# EAGLE design Smart Extruder Board (EAGLE 6.6.0)
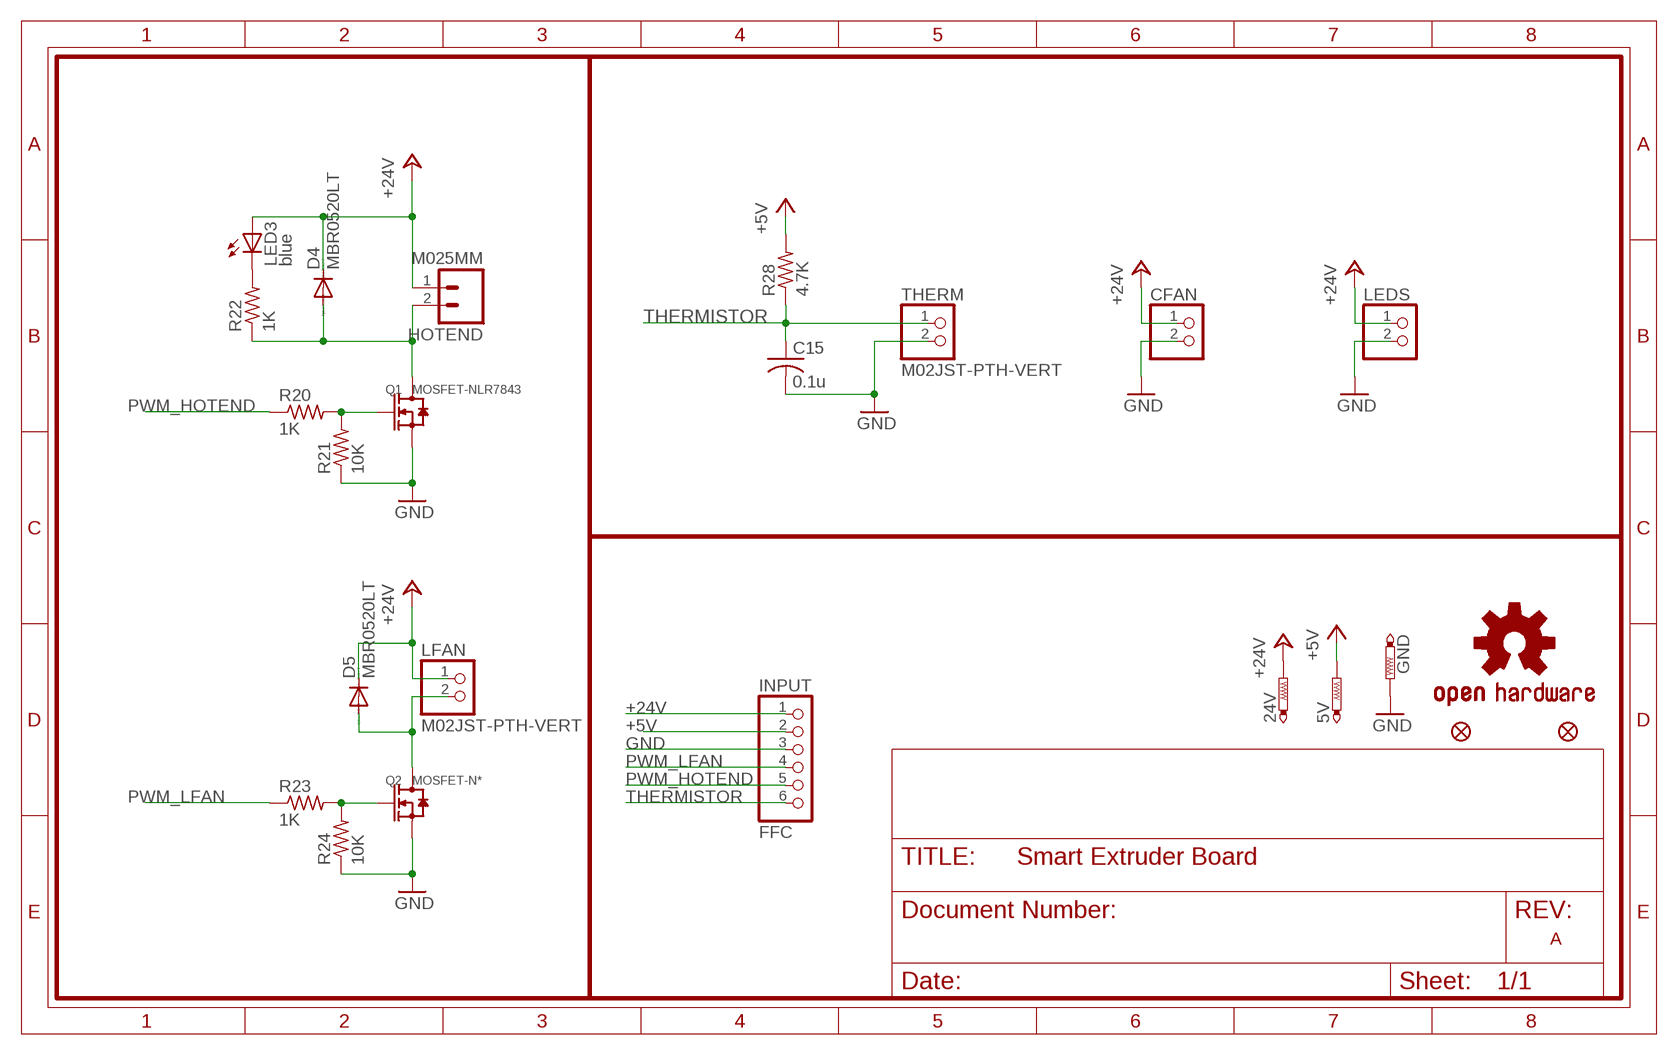
[diagram p0: schematic, sheet 1]

## Parts
5V  PTR1TP10SQ  [TP10SQ]
24V  PTR1TP10SQ  [TP10SQ]
C15  0.1u  C-USC0805  [C0805]
CFAN  PINHD-1X2/90  [1X02/90]
D4  MBR0520LT  [SOD123]
D5  MBR0520LT  [SOD123]
GND  PTR1TP10SQ  [TP10SQ]
HOTEND  M025MM  [SCREWTERMINAL-5MM-2]
INPUT  FFC  PINHD-1X6/90  [1X06/90]
JP1  SPARKFUN_FIDUCIAL1X2.5  [SPARKFUN_FIDUCIAL-1X2.5]
JP3  SPARKFUN_FIDUCIAL1X2.5  [SPARKFUN_FIDUCIAL-1X2.5]
LED3  blue  LEDCHIP-LED0805  [CHIP-LED0805]
LEDS  PINHD-1X2/90  [1X02/90]
LFAN  M02JST-PTH-VERT  PINHD-1X2/90  [1X02/90]
LOGO1  OSHW-LOGOS  [OSHW-LOGO-S]
Q1  MOSFET-NLR7843  [TO252]
Q2  MOSFET-N*  [SOT23]
R20  1K  R-US_M0805  [M0805]
R21  10K  R-US_M0805  [M0805]
R22  1K  R-US_M0805  [M0805]
R23  1K  R-US_M0805  [M0805]
R24  10K  R-US_M0805  [M0805]
R28  4.7K  R-US_M0805  [M0805]
THERM  M02JST-PTH-VERT  PINHD-1X2/90  [1X02/90]

## Nets
+5V: 5V.TP INPUT.2 R28.2
+24V: 24V.TP CFAN.1 D4.C D5.C HOTEND.1 INPUT.1 LED3.A LEDS.1 LFAN.1
GND: C15.2 CFAN.2 GND.TP INPUT.3 LEDS.2 Q1.2(S) Q2.2(S) R21.1 R24.1 THERM.2
N$61: Q1.1(G) R20.2 R21.2
N$62: D4.A HOTEND.2 Q1.3(D) R22.1
N$64: LED3.C R22.2
N$67: Q2.1(G) R23.2 R24.2
N$68: D5.A LFAN.2 Q2.3(D)
PWM_HOTEND: INPUT.5 R20.1
PWM_LFAN: INPUT.4 R23.1
THERMISTOR: C15.1 INPUT.6 R28.1 THERM.1

## Notes on the sheet
- A

## Library data of the parts
5V 24V GND = testpad:PTR1: TEST PIN; OC_FARNELL: unknown
C15 = rcl:C-US: CAPACITOR, American symbol; MF: AVX; MPN: 08055C104KAT2A; OC_FARNELL: 499687
CFAN LEDS LFAN THERM = pinhead:PINHD-1X2: PIN HEADER; OC_FARNELL: unknown
D4 D5 = diode:MBR0520LT: SCHOTTKY BARRIER RECTIFIER Source: http://onsemi.com .. MBR0520LT1-D.pdf; MF: DIODES INC.; MPN: B0530W-7-F; OC_FARNELL: 1843690
HOTEND = SparkFun-Connectors:M02: Standard 2-pin 0.1" header. Use with - straight break away headers ( PRT-00116) - right angle break away headers (PRT-00553) - swiss pins (PRT-00743) - machine pins (PRT-00117) - female headers (PRT-00115) Molex polarized connector foot print use with: PRT-08233 with associated crimp pins and housings. 2.54_SCREWTERM for use with PRT-10571. 3.5mm Screw Terminal footprints for PRT-08084 5mm Screw Terminal footprints for use with PRT-08432; OC_FARNELL: unknown; STOREFRONT_ID: PRT-08432
INPUT = pinhead:PINHD-1X6: PIN HEADER; OC_FARNELL: unknown
JP1 JP3 = SAV MK-I:SPARKFUN_FIDUCIAL: Fiducial Alignment Points Various fiducial points for machine vision alignment.; OC_FARNELL: unknown
LED3 = adafruit:LED: LED OSRAM: - CHIPLED LG R971, LG N971, LY N971, LG Q971, LY Q971, LO R971, LY R971 LH N974, LH R974 LS Q976, LO Q976, LY Q976 LO Q996 - Hyper CHIPLED LW Q18S LB Q993, LB Q99A, LB R99A - SideLED LS A670, LO A670, LY A670, LG A670, LP A670 LB A673, LV A673, LT A673, LW A673 LH A674 LY A675 LS A676, LA A676, LO A676, LY A676, LW A676 LS A679, LY A679, LG A679 - Hyper Micro SIDELED® LS Y876, LA Y876, LO Y876, LY Y876 LT Y87S - SmartLED LW L88C, LW L88S LB L89C, LB L89S, LG L890 LS L89K, LO L89K, LY L89K LS L896, LA L896, LO L896, LY L896 - TOPLED LS T670, LO T670, LY T670, LG T670, LP T670 LSG T670, LSP T670, LSY T670, LOP T670, LYG T670 LG T671, LOG T671, LSG T671 LB T673, LV T673, LT T673, LW T673 LH T674 LS T676, LA T676, LO T676, LY T676, LB T676, LH T676, LSB T676, LW T676 LB T67C, LV T67C, LT T67C, LS T67K, LO T67K, LY T67K, LW E67C LS E67B, LA E67B, LO E67B, LY E67B, LB E67C, LV E67C, LT E67C LW T67C LS T679, LY T679, LG T679 LS T770, LO T770, LY T770, LG T770, LP T770 LB T773, LV T773, LT T773, LW T773 LH T774 LS E675, LA E675, LY E675, LS T675 LS T776, LA T776, LO T776, LY T776, LB T776 LHGB T686 LT T68C, LB T68C - Hyper Mini TOPLED® LB M676 - Mini TOPLED Santana® LG M470 LS M47K, LO M47K, LY M47K Source: http://www.osram.convergy.de/; MF: MULTICOMP; MPN: OVS-0803; OC_FARNELL: 1716765RL
LOGO1 = SparkFun-Aesthetics:OSHW-LOGO: Open Source Hardware Logo This logo indicates the piece of hardware it is found on incorporates a OSHW license and/or adheres to the definition of open source hardware found here: http://freedomdefined.org/OSHW; OC_FARNELL: unknown
Q1 = MarcEagleParts:MOSFET-N: CJ2302：SMD MOSFET N-CH 20V-2.1A; MF: INTERNATIONAL RECTIFIER; MPN: IRLR7843PBF; OC_FARNELL: 1013422
Q2 = MarcEagleParts:MOSFET-N: CJ2302：SMD MOSFET N-CH 20V-2.1A; MF: INTERNATIONAL RECTIFIER; MPN: IRLML6344TRPBF; OC_FARNELL: 1857299
R20 R22 R23 = rcl:R-US_: RESISTOR, American symbol; MF: BOURNS; MPN: CR0805-JW-102ELF; OC_FARNELL: 2008389
R21 R24 = rcl:R-US_: RESISTOR, American symbol; MF: BOURNS; MPN: CR0805-JW-103ELF; OC_FARNELL: 2008390
R28 = rcl:R-US_: RESISTOR, American symbol; MF: BOURNS; MPN: CR0805-FX-4701GLF; OC_FARNELL: 2008383

## Net classes
0 default: width 0.305 mm, drill 0.254 mm, clearance 0.254 mm

## Board
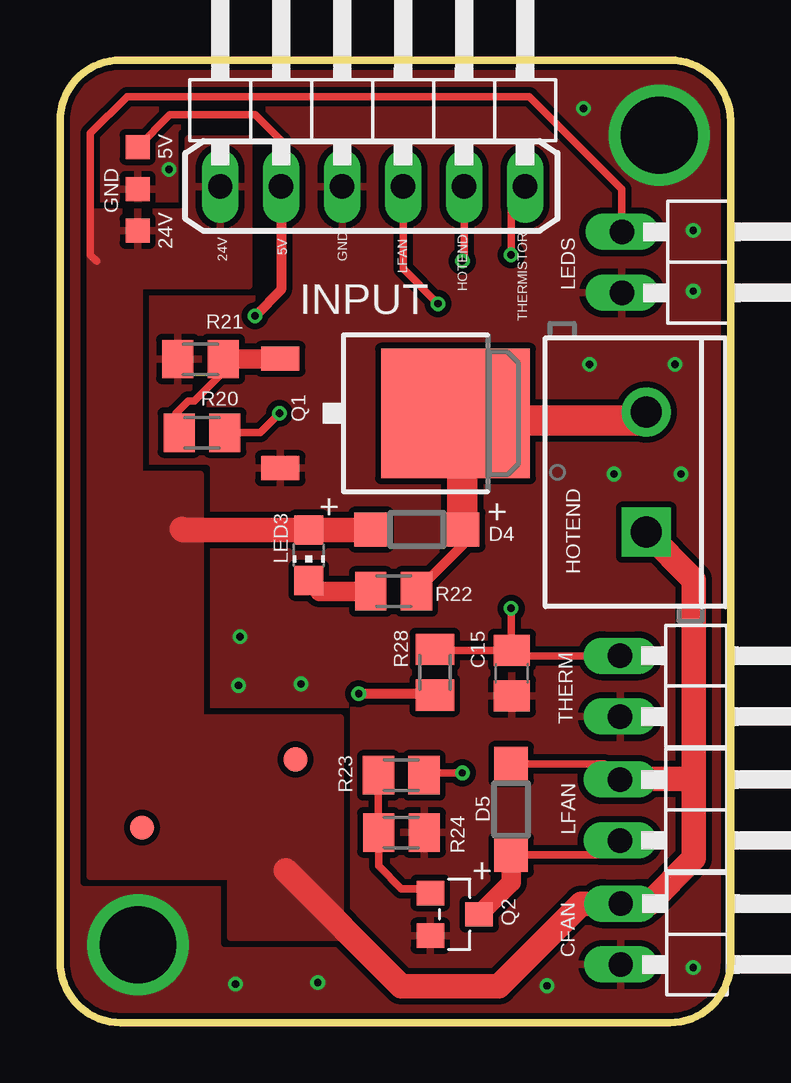
[diagram p1: board, top side]
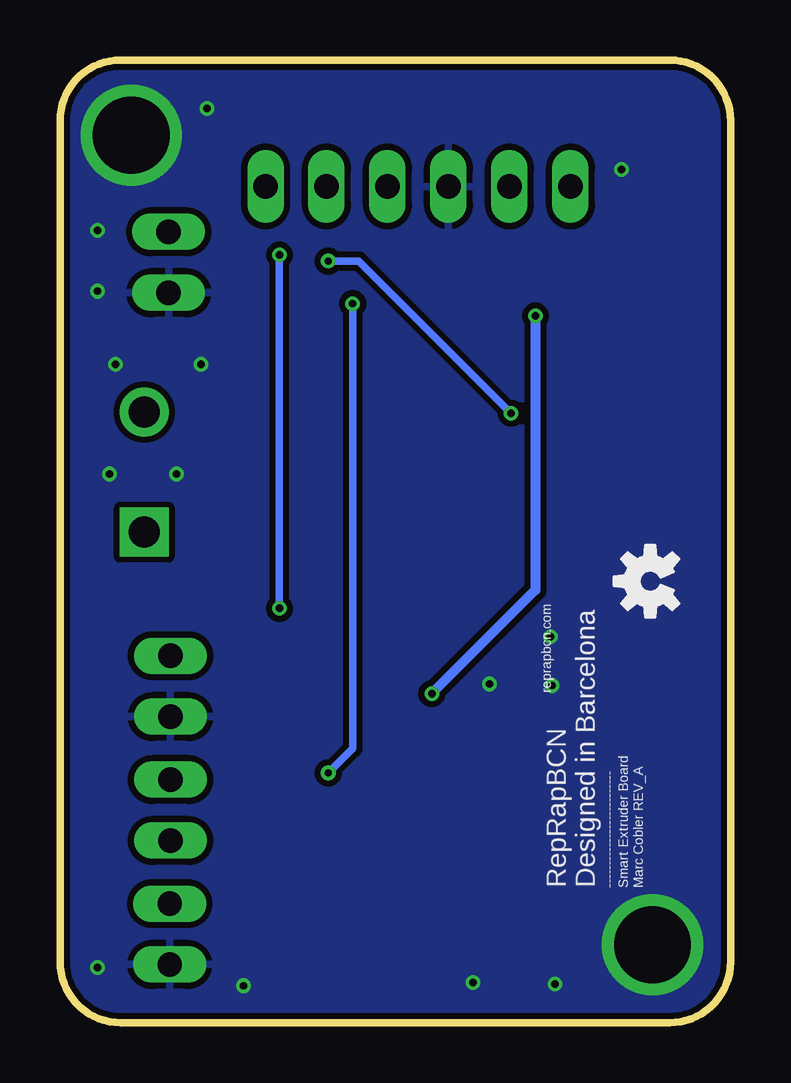
[diagram p2: board, bottom side, seen from below]

Size 27.94 x 40.13 mm. Coordinates in mm from the lower left corner, seen from the top.
Outline: 2.54,40.13 25.4,40.13 arc-90 27.94,37.59 27.94,2.54 arc-90 25.4,0 2.54,0 arc-90 0,2.54 0,37.59 arc-90 2.54,40.13
Copper layers (1*16): Top 0.035mm / dielectric 1.5mm / Bottom 0.035mm
Design rules "ITEADstudio_DRC": minimum track width 6mil, minimum drill 12mil, track to track 6mil, track to pad 6mil, pad to pad 6mil, via to via 6mil, smd to smd 0mil, copper to edge 10mil, drill to drill 10mil, minimum pad ring 10mil, minimum via ring 6mil, stop-mask expansion 2mil, vias tented up to drill 100mil, thermal gap 10mil

### Footprints (pad centres in the part's own frame; a part is rotated, then mirrored left to right if it is on the bottom)
TP10SQ = smd 1 x 1: TP 0,0
C0805 = smd 1.3 x 1.5: 1 -0.95,0; 2 0.95,0
1X02/90 = drill 1.016 long: 1 -1.27,-3.81; 2 1.27,-3.81
SOD123 = smd 1.4 x 1.4: A 1.9,0; C -1.9,0
SCREWTERMINAL-5MM-2 = drill 1.3 pad 2.032 square: 1 0,0 | drill 1.3 pad 2.032: 2 5,0
1X06/90 = drill 1.016 long: 1 -6.35,-3.81; 2 -3.81,-3.81; 3 -1.27,-3.81; 4 1.27,-3.81; 5 3.81,-3.81; 6 6.35,-3.81
SPARKFUN_FIDUCIAL-1X2.5 = smd 1 x 1: 1 0,0
CHIP-LED0805 = smd 1.2 x 1.2: A 0,-1.05; C 0,1.05
TO252 = smd 1 x 1.6: 1 -2.28,-4.8; 2 2.28,-4.8 | smd 5.4 x 6.2: 3 0,2.5
SOT23 = smd 1.016 x 1.143: 1 -0.889,-1.016; 2 0.889,-1.016; 3 0,1.016
M0805 = smd 1.3 x 1.6: 1 -0.95,0; 2 0.95,0

### Placement (x,y rotation side)
5V  3.23,36.5 90 top
24V  3.23,33.01 90 top
C15  18.82,14.57 270 top
CFAN  27.18,3.69 270 top
D4  14.87,20.56 0 top
D5  18.8,8.89 270 top
DRILEGEND  [DRILEGEND]  -0.13,-0.1 0 top
GND  3.23,34.75 90 top
HOTEND  24.43,20.45 90 top
INPUT  13.03,38.67 0 top
JP1  9.82,10.98 0 top
JP3  3.42,8.13 0 top
LED3  10.37,19.49 180 top
LEDS  27.23,31.7 270 top
LFAN  27.15,8.87 270 top
LOGO1  3.35,18.4 90 bottom
Q1  13.98,25.4 270 top
Q2  16.45,4.52 270 top
R20  5.91,24.6 180 top
R21  5.85,27.66 0 top
R22  13.9,17.98 180 top
R23  14.22,10.31 180 top
R24  14.23,7.93 180 top
R28  15.62,14.61 270 top
THERM  27.15,14.03 270 top

### Tracks (layer width: path | path; a pad name or v marks a point on that pad's centre or on a via)
+5V  (via drill 0.3)
  Top 0.305: INPUT.2 9.22,36.76 8.13,37.85 4.58,37.85 5V.TP
  Top 0.406: INPUT.2 9.22,30.55 v8.13,29.46 | v12.45,13.72 15.56,13.72 R28.2
  Bottom 0.406: v8.13,29.46 8.13,18.03 v12.45,13.72
+24V
  Top 0.305: LFAN.1 22.68,10.79 D5.C | LEDS.1 23.42,34.75 19.56,38.61 2.79,38.61 1.27,37.08 1.27,32 1.52,31.75
  Top 1.016: D4.C 12.95,20.54 LED3.A 5.12,20.54 5.08,20.57 | HOTEND.1 26.42,18.46 26.42,10.16 | 26.42,10.16 26.42,6.86 24.52,4.96 CFAN.1 21.73,4.96 18.29,1.52 14.22,1.52 9.4,6.35 | LFAN.1 23.36,10.16 26.42,10.16
  pour Top: 7.87,33.53 7.87,36.83 5.33,36.83 5.33,33.78 1.27,33.78 1.27,6.1 7.11,6.1 7.11,3.56 11.68,3.56 11.68,12.7 5.84,12.7 5.84,22.86 3.3,22.86 3.3,30.73 7.87,30.73
GND  (via drill 0.3 pad 0.25, 3.2 pad 1.68)
  other vias: 7.5,16.09 10.04,14.12 10.74,1.67 7.44,14.06 7.32,1.61 3.25,3.25 24.97,37 22.07,27.45 25.62,27.45 25.88,22.87 23.08,22.87 21.81,38.11 26.38,33.03 26.38,30.49 26.38,2.3 20.29,1.54 4.54,35.57
  pour Top (rank 6): 27.94,40.13 27.94,-0.25 -0.25,-0.51 0,40.39
  pour Bottom: 0.01,40.24 27.96,40.24 27.96,-0.23 0.01,-0.23
N$61
  Top 0.305: R21.2 6.8,27.12 5.59,25.91 5.33,25.91 4.83,25.4 4.83,24.74 R20.2
  Top 0.813: R21.2 9.16,27.66 Q1.1
N$62
  Top 0.406: D4.A 16.77,19.9 R22.1
  Top 1.27: D4.A 16.77,25.11 | 16.77,25.11 Q1.3 | 16.77,25.11 24.08,25.11 HOTEND.2
N$64
  Top 0.813: R22.2 10.82,17.98 LED3.C
N$67
  Top 0.305: R23.2 13.27,7.94 R24.2 13.28,6.54 14.22,5.59 15.25,5.59 Q2.1
N$68
  Top 0.305: LFAN.2 22.73,6.99 D5.A
  Top 0.813: Q2.3 18.8,5.85 D5.A
PWM_HOTEND  (via drill 0.3)
  Top 0.305: R20.1 8.34,24.6 v9.14,25.4 | v16.76,31.75 16.84,31.82 INPUT.5
  Bottom 0.305: v9.14,25.4 15.49,31.75 v16.76,31.75
PWM_LFAN  (via drill 0.3)
  Top 0.305: INPUT.4 14.3,31.42 v15.75,29.97 | v16.76,10.41 15.27,10.41 R23.1
  Bottom 0.305: v15.75,29.97 15.75,11.43 v16.76,10.41
THERMISTOR  (via drill 0.3)
  Top 0.305: THERM.1 19.05,15.3 C15.1 18.8,15.52 | INPUT.6 18.8,34.28 v18.8,32 | v18.8,17.27 18.8,15.52 | 18.8,15.52 15.65,15.52 R28.1
  Bottom 0.305: v18.8,32 v18.8,17.27

### Text on the board
tNames: 5V | 24V | GND | LFAN | HOTEND | THERMISTOR | + | +
bNames: reprapbcn.com | -------------------------- / Smart Extruder Board / Marc Cobler REV_A | RepRapBCN / Designed in Barcelona
DrillLegend: LAYER-STACK
DrillLegend_01-16: 01-16